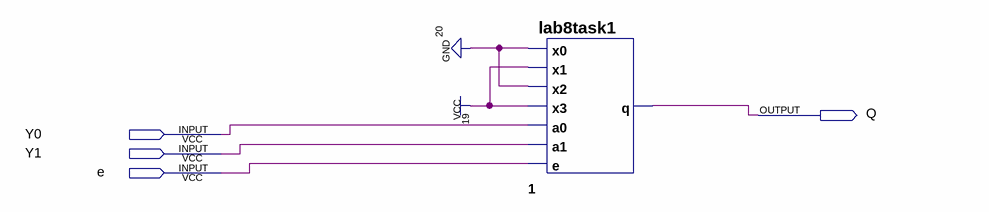
[diagram p0: schematic sheet]
// Quartus schematic lab8task81.bdf as structural Verilog: 1 symbols, 4 pins
module lab8task81 (
  input  Y0,
  input  Y1,
  input  e,
  output Q
);

  lab8task1 u_1 (.x0(1'b0), .x1(1'b1), .x2(1'b0), .x3(1'b1), .a0(Y0), .a1(Y1), .e(e), .q(Q));
endmodule
